# EAGLE design SEGplug (EAGLE 6.2)
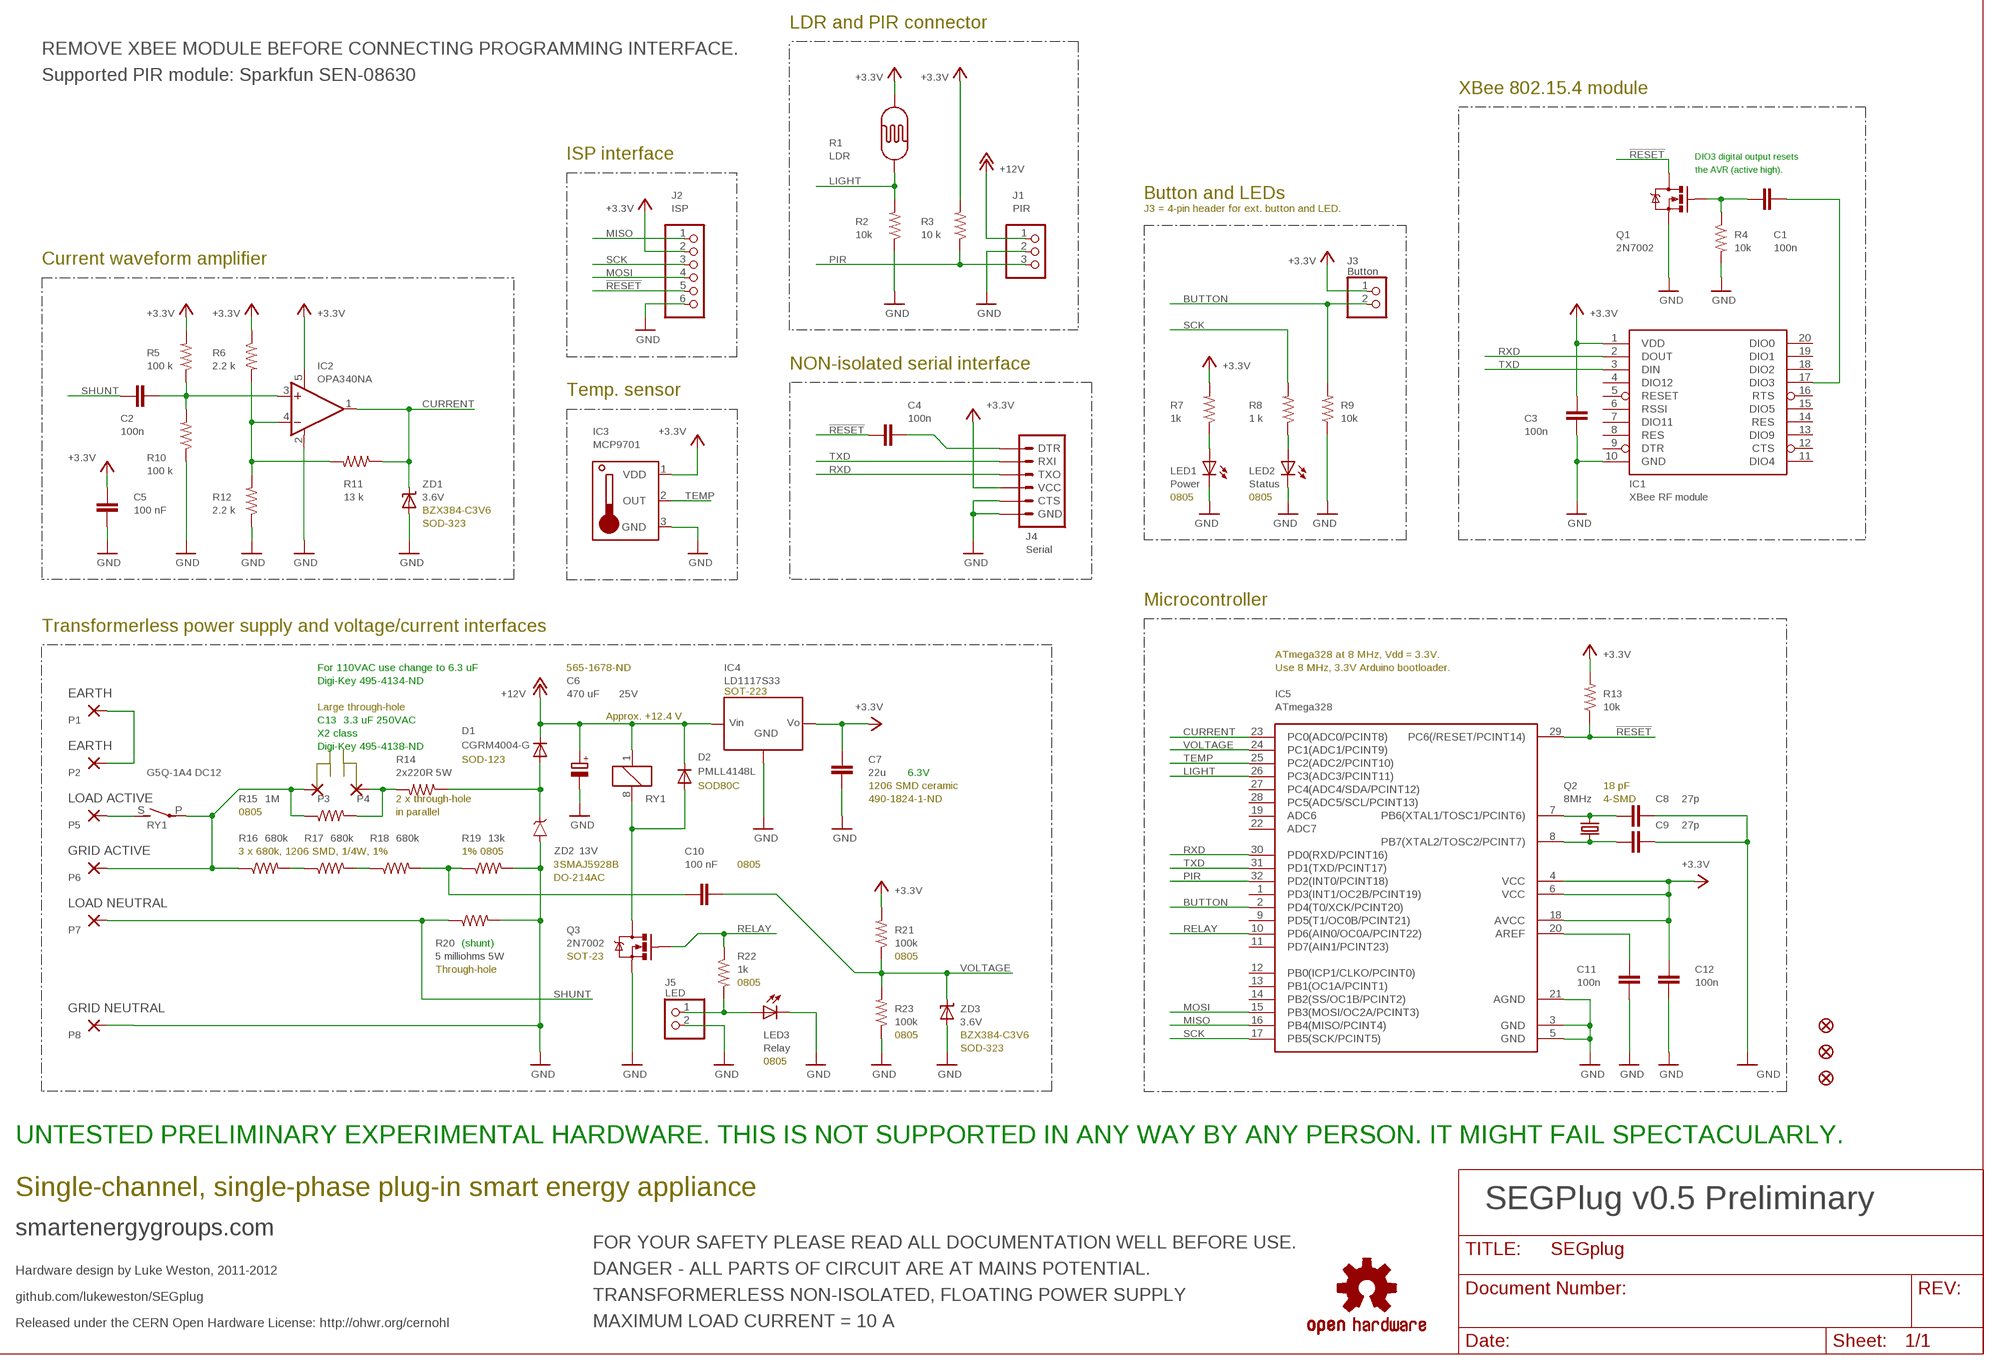
[diagram p0: schematic, sheet 1, part 1 of 2]
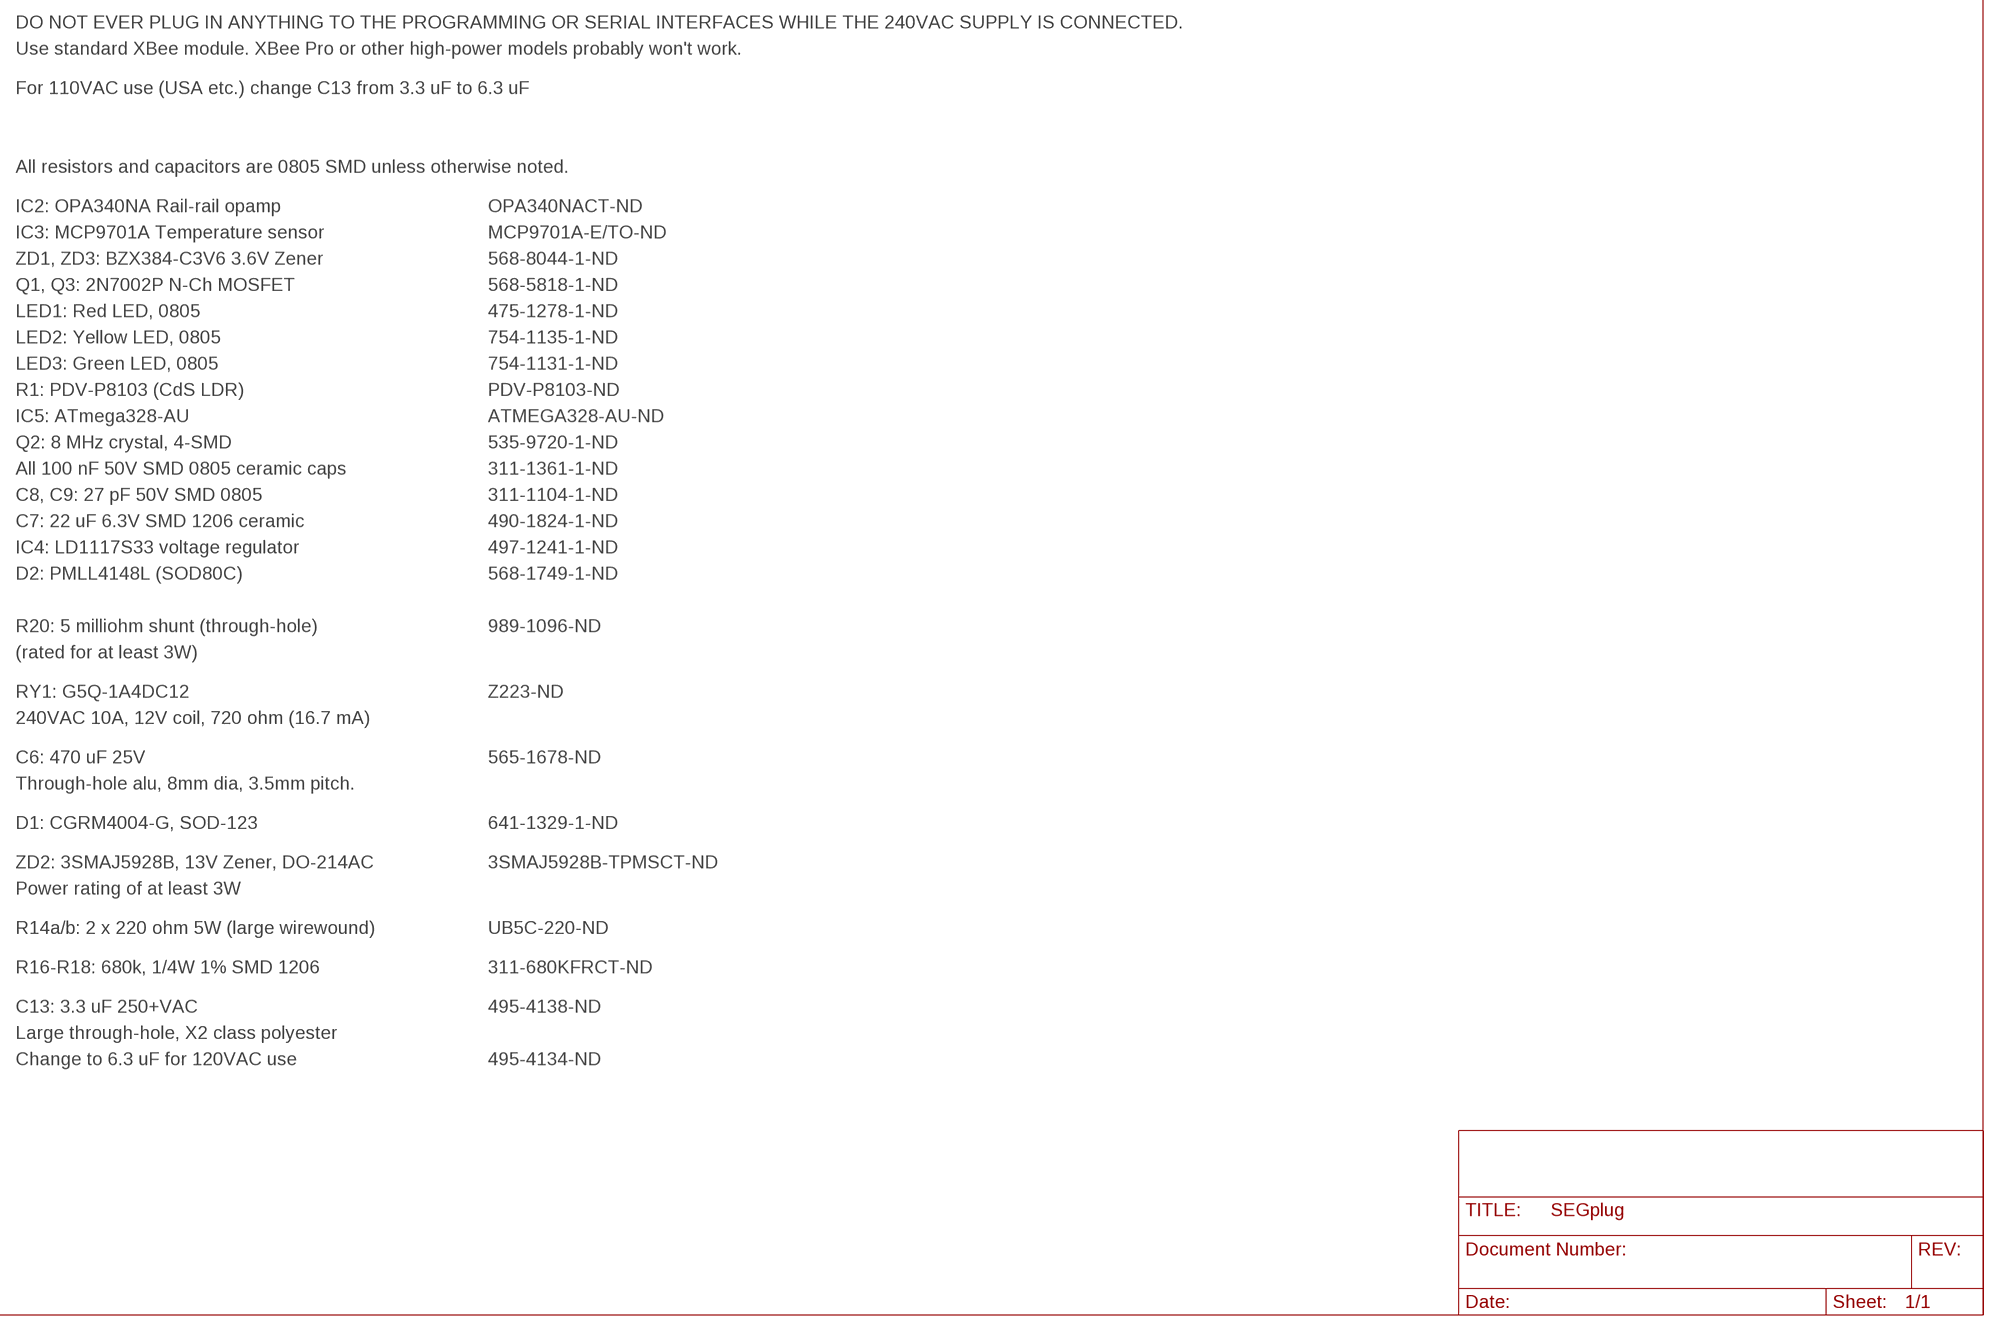
[diagram p1: schematic, sheet 1, part 2 of 2]

## Parts
C1  100n  C-EUC0805K  [C0805K]
C2  100n  C-EUC0805K  [C0805K]
C3  100n  C-EUC0805K  [C0805K]
C4  100n  C-EUC0805K  [C0805K]
C5  100 nF  C-EUC0805K  [C0805K]
C6  470 uF  CPOL-EUE3.5-8  [E3,5-8]
C7  22u  C-EUC1206K  [C1206K]
C8  27p  C-EUC0805K  [C0805K]
C9  27p  C-EUC0805K  [C0805K]
C10  100 nF  C-EUC0805K  [C0805K]
C11  100n  C-EUC0805K  [C0805K]
C12  100n  C-EUC0805K  [C0805K]
D1  CGRM4004-G  [SOD-123_MINI-SMA]
D2  PMLL4148L  DIODE-MINIMELF  [MINIMELF]
IC1  XBee RF module  XBEE-1B3  [XBEE-SMD]
IC2  OPA340NA  OPA336N  [SOT23-5]
IC3  MCP9701  MCP9700  [TO92]
IC4  LD1117S33  REG1117  [SOT223]
IC5  ATmega328  MEGA48/88/168-AU  [TQFP32-08]
J1  PIR  PINHD-1X3  [1X03]
J2  ISP  PINHD-1X6  [1X06]
J3  Button  PINHD-1X2  [1X02]
J4  Serial  ARDUINO_SERIAL_PROGRAMPTH  [1X06]
J5  LED  PINHD-1X2  [1X02]
JP1  FIDUCIAL1X2  [FIDUCIAL-1X2]
JP2  FIDUCIAL1X2  [FIDUCIAL-1X2]
JP3  FIDUCIAL1X2  [FIDUCIAL-1X2]
LED1  Power  LEDCHIPLED_0805  [CHIPLED_0805]
LED2  Status  LEDCHIPLED_0805  [CHIPLED_0805]
LED3  Relay  LEDCHIPLED_0805  [CHIPLED_0805]
P1  EARTH  WIREPAD4,16O1,6  [4,16O1,6]
P2  EARTH  WIREPAD4,16O1,6  [4,16O1,6]
P3  CAP  WIREPAD4,16O1,6  [4,16O1,6]
P4  CAP  WIREPAD4,16O1,6  [4,16O1,6]
P5  LOAD ACTIVE  WIREPAD4,16O1,6  [4,16O1,6]
P6  GRID ACTIVE  WIREPAD4,16O1,6  [4,16O1,6]
P7  LOAD NEUTRAL  WIREPAD4,16O1,6  [4,16O1,6]
P8  GRID NEUTRAL  WIREPAD4,16O1,6  [4,16O1,6]
Q1  2N7002  MOSFET-NCHANNELSMD  [SOT23-3]
Q2  8MHz  CRYSTAL5X3  [CRYSTAL-SMD-5X3]
Q3  2N7002  MOSFET-NCHANNELSMD  [SOT23-3]
R1  LDR  PHOTOCELLPTH  [PHOTOCELL]
R2  10k  R-US_M0805  [M0805]
R3  10 k  R-US_M0805  [M0805]
R4  10k  R-US_M0805  [M0805]
R5  100 k  R-US_M0805  [M0805]
R6  2.2 k  R-US_M0805  [M0805]
R7  1k  R-US_M0805  [M0805]
R8  1 k  R-US_M0805  [M0805]
R9  10k  R-US_M0805  [M0805]
R10  100 k  R-US_M0805  [M0805]
R11  13 k  R-US_M0805  [M0805]
R12  2.2 k  R-US_M0805  [M0805]
R13  10k  R-US_M0805  [M0805]
R14  2x220R 5W  R-US_0617/17  [0617/17]
R15  1M  R-US_M0805  [M0805]
R16  680k  R-US_M1206  [M1206]
R17  680k  R-US_M1206  [M1206]
R18  680k  R-US_M1206  [M1206]
R19  13k  R-US_M0805  [M0805]
R20  5 milliohms 5W  RSENSE2_RSENSE  [RSENSE2_RSENSE]
R21  100k  R-US_M0805  [M0805]
R22  1k  R-US_M0805  [M0805]
R23  100k  R-US_M0805  [M0805]
RY1  G5Q-1A4 DC12  G6C-1117P  [G6C-1117P]
U$  OSHW-LOGOS  [OSHW-LOGO-S]
ZD1  3.6V  DIODE-ZENER-BZT52  [SOD-323]
ZD2  13V  ZENER  [DO214AC]
ZD3  3.6V  DIODE-ZENER-BZT52  [SOD-323]

## Nets
!RESET: C4.2 IC5.29(PC6(/RESET/PCINT14)) J2.5 Q1.3(D) R13.1
+3V3: C3.1 C5.1 C7.1 C12.1 IC1.1(VDD) IC2.5(V+) IC3.1(VDD) IC4.2(VOUT) IC5.4(VCC) IC5.6(VCC) IC5.18(AVCC) J2.2 J3.1 J4.4(VCC) R1.2 R3.2 R5.2 R6.1 R7.2 R13.2 R21.2 ; supply symbol labelled +3.3V
+12V: C6.+ D1.C D2.C IC4.3(VIN) J1.1 RY1.1
BUTTON: IC5.2(PD4(T0/XCK/PCINT20)) J3.2 R9.2
CURRENT: IC2.1(OUT) IC5.23(PC0(ADC0/PCINT8)) R11.1 ZD1.1(C)
DIO3: C1.1 IC1.17(DIO3)
GND: C3.2 C5.2 C6.- C7.2 C8.2 C9.2 C11.2 C12.2 IC1.10(GND) IC2.2(V-) IC3.3(GND) IC4.1(GND) IC5.3(GND) IC5.5(GND) IC5.21(AGND) J1.2 J2.6 J4.5(CTS) J4.6(GND) J5.2 LED1.C LED2.C LED3.C P8.1(P) Q1.2(S) Q3.2(S) R2.1 R4.2 R9.1 R10.1 R12.1 R19.2 R20.P$2 R23.1 ZD1.2(A) ZD2.A ZD3.2(A)
LIGHT: IC5.26(PC3(ADC3/PCINT11)) R1.1 R2.2
MISO: IC5.16(PB4(MISO/PCINT4)) J2.1
MOSI: IC5.15(PB3(MOSI/OC2A/PCINT3)) J2.4
N$1: LED1.A R7.1
N$2: P3.1(P) P6.1(P) R15.1 R16.1 RY1.P(2:P)
N$3: R17.2 R18.1
N$4: D2.A Q3.3(D) RY1.8
N$5: J5.1 LED3.A R22.2
N$6: P5.1(P) RY1.S(2:S)
N$9: C11.1 IC5.20(AREF)
N$10: P1.1(P) P2.1(P)
N$13: C8.1 IC5.7(PB6(XTAL1/TOSC1/PCINT6)) Q2.3
N$14: C9.1 IC5.8(PB7(XTAL2/TOSC2/PCINT7)) Q2.1
N$16: LED2.A R8.1
N$18: C1.2 Q1.1(G) R4.1
N$20: P4.1(P) R14.2 R15.2
N$22: D1.A R14.1 ZD2.C
N$23: C10.2 R18.2 R19.1
N$24: C4.1 J4.1(DTR)
N$25: R16.2 R17.1
N$26: IC2.4(-IN) R6.2 R11.2 R12.2
N$28: C2.1 IC2.3(+IN) R5.1 R10.2
PIR: IC5.32(PD2(INT0/PCINT18)) J1.3 R3.1
RELAY: IC5.10(PD6(AIN0/OC0A/PCINT22)) Q3.1(G) R22.1
RXD: IC1.2(DOUT) IC5.30(PD0(RXD/PCINT16)) J4.3(TXO)
SCK: IC5.17(PB5(SCK/PCINT5)) J2.3 R8.2
SHUNT: C2.2 P7.1(P) R20.P$1
TEMP: IC3.2(OUT) IC5.25(PC2(ADC2/PCINT10))
TXD: IC1.3(DIN) IC5.31(PD1(TXD/PCINT17)) J4.2(RXI)
VOLTAGE: C10.1 IC5.24(PC1(ADC1/PCINT9)) R21.1 R23.2 ZD3.1(C)
Unconnected: IC1.4(DIO12) IC1.5(RESET) IC1.6(RSSI) IC1.7(DIO11) IC1.8(RES) IC1.9(DTR) IC1.11(DIO4) IC1.12(CTS) IC1.13(DIO9) IC1.14(RES) IC1.15(DIO5) IC1.16(RTS) IC1.18(DIO2) IC1.19(DIO1) IC1.20(DIO0) IC5.1(PD3(INT1/OC2B/PCINT19)) IC5.9(PD5(T1/OC0B/PCINT21)) IC5.11(PD7(AIN1/PCINT23)) IC5.12(PB0(ICP1/CLKO/PCINT0)) IC5.13(PB1(OC1A/PCINT1)) IC5.14(PB2(SS/OC1B/PCINT2)) IC5.19(ADC6) IC5.22(ADC7) IC5.27(PC4(ADC4/SDA/PCINT12)) IC5.28(PC5(ADC5/SCL/PCINT13))

## Notes on the sheet
- LDR and PIR connector
- REMOVE XBEE MODULE BEFORE CONNECTING PROGRAMMING INTERFACE.
- Supported PIR module: Sparkfun SEN-08630
- XBee 802.15.4 module
- ISP interface | DIO3 digital output resets
- the AVR (active high).
- Button and LEDs
- J3 = 4-pin header for ext. button and LED.
- Current waveform amplifier
- NON-isolated serial interface
- Temp. sensor
- 0805 | 0805
- BZX384-C3V6
- SOD-323
- Microcontroller
- Transformerless power supply and voltage/current interfaces
- ATmega328 at 8 MHz, Vdd = 3.3V.
- For 110VAC use change to 6.3 uF | 565-1678-ND | Use 8 MHz, 3.3V Arduino bootloader.
- Digi-Key 495-4134-ND
- 25V | SOT-223
- Large through-hole
- Approx. +12.4 V
- C13 | 3.3 uF 250VAC
- X2 class
- Digi-Key 495-4138-ND
- SOD-123
- 6.3V
- SOD80C | 1206 SMD ceramic | 18 pF
- 2 x through-hole | 490-1824-1-ND | 4-SMD
- 0805 | in parallel
- 3 x 680k, 1206 SMD, 1/4W, 1% | 1% 0805
- 3SMAJ5928B | 0805
- DO-214AC
- (shunt)
- SOT-23 | 0805
- Through-hole
- 0805
- 0805 | BZX384-C3V6
- SOD-323
- 0805
- UNTESTED PRELIMINARY EXPERIMENTAL HARDWARE. THIS IS NOT SUPPORTED IN ANY WAY BY ANY PERSON. IT MIGHT FAIL SPECTACULARLY.
- Single-channel, single-phase plug-in smart energy appliance
- SEGPlug v0.5 Preliminary
- smartenergygroups.com
- FOR YOUR SAFETY PLEASE READ ALL DOCUMENTATION WELL BEFORE USE.
- Hardware design by Luke Weston, 2011-2012 | DANGER - ALL PARTS OF CIRCUIT ARE AT MAINS POTENTIAL.
- github.com/lukeweston/SEGplug | TRANSFORMERLESS NON-ISOLATED, FLOATING POWER SUPPLY
- Released under the CERN Open Hardware License: http://ohwr.org/cernohl | MAXIMUM LOAD CURRENT = 10 A
- DO NOT EVER PLUG IN ANYTHING TO THE PROGRAMMING OR SERIAL INTERFACES WHILE THE 240VAC SUPPLY IS CONNECTED.
- Use standard XBee module. XBee Pro or other high-power models probably won't work.
- For 110VAC use (USA etc.) change C13 from 3.3 uF to 6.3 uF
- All resistors and capacitors are 0805 SMD unless otherwise noted.
- IC2: OPA340NA Rail-rail opamp | OPA340NACT-ND
- IC3: MCP9701A Temperature sensor | MCP9701A-E/TO-ND
- ZD1, ZD3: BZX384-C3V6 3.6V Zener | 568-8044-1-ND
- Q1, Q3: 2N7002P N-Ch MOSFET | 568-5818-1-ND
- LED1: Red LED, 0805 | 475-1278-1-ND
- LED2: Yellow LED, 0805 | 754-1135-1-ND
- LED3: Green LED, 0805 | 754-1131-1-ND
- R1: PDV-P8103 (CdS LDR) | PDV-P8103-ND
- IC5: ATmega328-AU | ATMEGA328-AU-ND
- Q2: 8 MHz crystal, 4-SMD | 535-9720-1-ND
- All 100 nF 50V SMD 0805 ceramic caps | 311-1361-1-ND
- C8, C9: 27 pF 50V SMD 0805 | 311-1104-1-ND
- C7: 22 uF 6.3V SMD 1206 ceramic | 490-1824-1-ND
- IC4: LD1117S33 voltage regulator | 497-1241-1-ND
- D2: PMLL4148L (SOD80C) | 568-1749-1-ND
- R20: 5 milliohm shunt (through-hole) | 989-1096-ND
- (rated for at least 3W)
- RY1: G5Q-1A4DC12 | Z223-ND
- 240VAC 10A, 12V coil, 720 ohm (16.7 mA)
- C6: 470 uF 25V | 565-1678-ND
- Through-hole alu, 8mm dia, 3.5mm pitch.
- D1: CGRM4004-G, SOD-123 | 641-1329-1-ND
- ZD2: 3SMAJ5928B, 13V Zener, DO-214AC | 3SMAJ5928B-TPMSCT-ND
- Power rating of at least 3W
- R14a/b: 2 x 220 ohm 5W (large wirewound) | UB5C-220-ND
- R16-R18: 680k, 1/4W 1% SMD 1206 | 311-680KFRCT-ND
- C13: 3.3 uF 250+VAC | 495-4138-ND
- Large through-hole, X2 class polyester
- Change to 6.3 uF for 120VAC use | 495-4134-ND

## Library data of the parts
C1-C5 C7-C12 = rcl:C-EU: CAPACITOR, European symbol
C6 = rcl:CPOL-EU: POLARIZED CAPACITOR, European symbol
D1 = diode:CGRM400*-G: Molded plasitc,JEDEC SOD-123/Mini SMA Source: Comchip CGRM4001-G.pdf
D2 = diode:DIODE-: DIODE
IC1 = SparkFun:XBEE-1
IC2 = burr-brown:OPA336: CMOS Operational Amplifiers Single-Supply, MicroPower, MicroAmplifier(TM) Series; MPN: OPA336NA; OC_FARNELL: 1212297; OC_NEWARK: 01M8405
IC3 = Luke:MCP9700
IC4 = burr-brown:REG1117: 800mA and 1A Low Dropout (LDO) Positive Regulator 1.8V, 2.5V, 2.85V, 3.3V, 5V, and Adj; MPN: REG1117; OC_FARNELL: 1097566; OC_NEWARK: 14P6981
IC5 = avr-5:MEGA48/88/168
J1 = pinhead:PINHD-1X3: PIN HEADER
J2 = pinhead:PINHD-1X6: PIN HEADER
J3 J5 = pinhead:PINHD-1X2: PIN HEADER
J4 = SparkFun:ARDUINO_SERIAL_PROGRAM
JP1-JP3 = SparkFun:FIDUCIAL: Fiducial Alignment Points Various fiducial points for machine vision alignment.
LED1-LED3 = led:LED: LED OSRAM: - CHIPLED LG R971, LG N971, LY N971, LG Q971, LY Q971, LO R971, LY R971 LH N974, LH R974 LS Q976, LO Q976, LY Q976 LO Q996 - Hyper CHIPLED LW Q18S LB Q993, LB Q99A, LB R99A - SideLED LS A670, LO A670, LY A670, LG A670, LP A670 LB A673, LV A673, LT A673, LW A673 LH A674 LY A675 LS A676, LA A676, LO A676, LY A676, LW A676 LS A679, LY A679, LG A679 - Hyper Micro SIDELED® LS Y876, LA Y876, LO Y876, LY Y876 LT Y87S - SmartLED LW L88C, LW L88S LB L89C, LB L89S, LG L890 LS L89K, LO L89K, LY L89K LS L896, LA L896, LO L896, LY L896 - TOPLED LS T670, LO T670, LY T670, LG T670, LP T670 LSG T670, LSP T670, LSY T670, LOP T670, LYG T670 LG T671, LOG T671, LSG T671 LB T673, LV T673, LT T673, LW T673 LH T674 LS T676, LA T676, LO T676, LY T676, LB T676, LH T676, LSB T676, LW T676 LB T67C, LV T67C, LT T67C, LS T67K, LO T67K, LY T67K, LW E67C LS E67B, LA E67B, LO E67B, LY E67B, LB E67C, LV E67C, LT E67C LW T67C LS T679, LY T679, LG T679 LS T770, LO T770, LY T770, LG T770, LP T770 LB T773, LV T773, LT T773, LW T773 LH T774 LS E675, LA E675, LY E675, LS T675 LS T776, LA T776, LO T776, LY T776, LB T776 LHGB T686 LT T68C, LB T68C - Hyper Mini TOPLED® LB M676 - Mini TOPLED Santana® LG M470 LS M47K, LO M47K, LY M47K Source: http://www.osram.convergy.de LUXEON: - LUMILED® LXK2-PW12-R00, LXK2-PW12-S00, LXK2-PW14-U00, LXK2-PW14-V00 LXK2-PM12-R00, LXK2-PM12-S00, LXK2-PM14-U00 LXK2-PE12-Q00, LXK2-PE12-R00, LXK2-PE12-S00, LXK2-PE14-T00, LXK2-PE14-U00 LXK2-PB12-K00, LXK2-PB12-L00, LXK2-PB12-M00, LXK2-PB14-N00, LXK2-PB14-P00, LXK2-PB14-Q00 LXK2-PR12-L00, LXK2-PR12-M00, LXK2-PR14-Q00, LXK2-PR14-R00 LXK2-PD12-Q00, LXK2-PD12-R00, LXK2-PD12-S00 LXK2-PH12-R00, LXK2-PH12-S00 LXK2-PL12-P00, LXK2-PL12-Q00, LXK2-PL12-R00 Source: www.luxeon.com KINGBRIGHT: KA-3528ASYC Source: www.kingbright.com
P1-P8 = wirepad:WIREPAD: Wire PAD connect wire on PCB
Q1 Q3 = freetronics-master-v1:MOSFET-NCHANNEL
Q2 = SparkFun:CRYSTAL: Crystals Various standard crystals. Proven footprints. Spark Fun Electronics SKU : COM-00534
R1 = SparkFun:PHOTOCELL
R2-R13 R19 R21-R23 = resistor:R-US_: RESISTOR, American symbol
R14-R18 = rcl:R-US_: RESISTOR, American symbol
R20 = SEGplug:RSENSE2_RSENSE
RY1 = relay:G6C-1117P: RELAY 1 x norm. open, 10 A/240 V, Omron; OC_FARNELL: unknown; OC_NEWARK: unknown
U$ = SparkFun:OSHW-LOGO: Open Source Hardware Logo This logo indicates the piece of hardware it is found on incorporates a OSHW license and/or adheres to the definition of open source hardware found here: http://freedomdefined.org/OSHW
ZD1 ZD3 = SparkFun:DIODE-ZENER: Zener Diode Production Part - 8199 3.4V Zener Voltage
ZD2 = Luke:ZENER

## Board
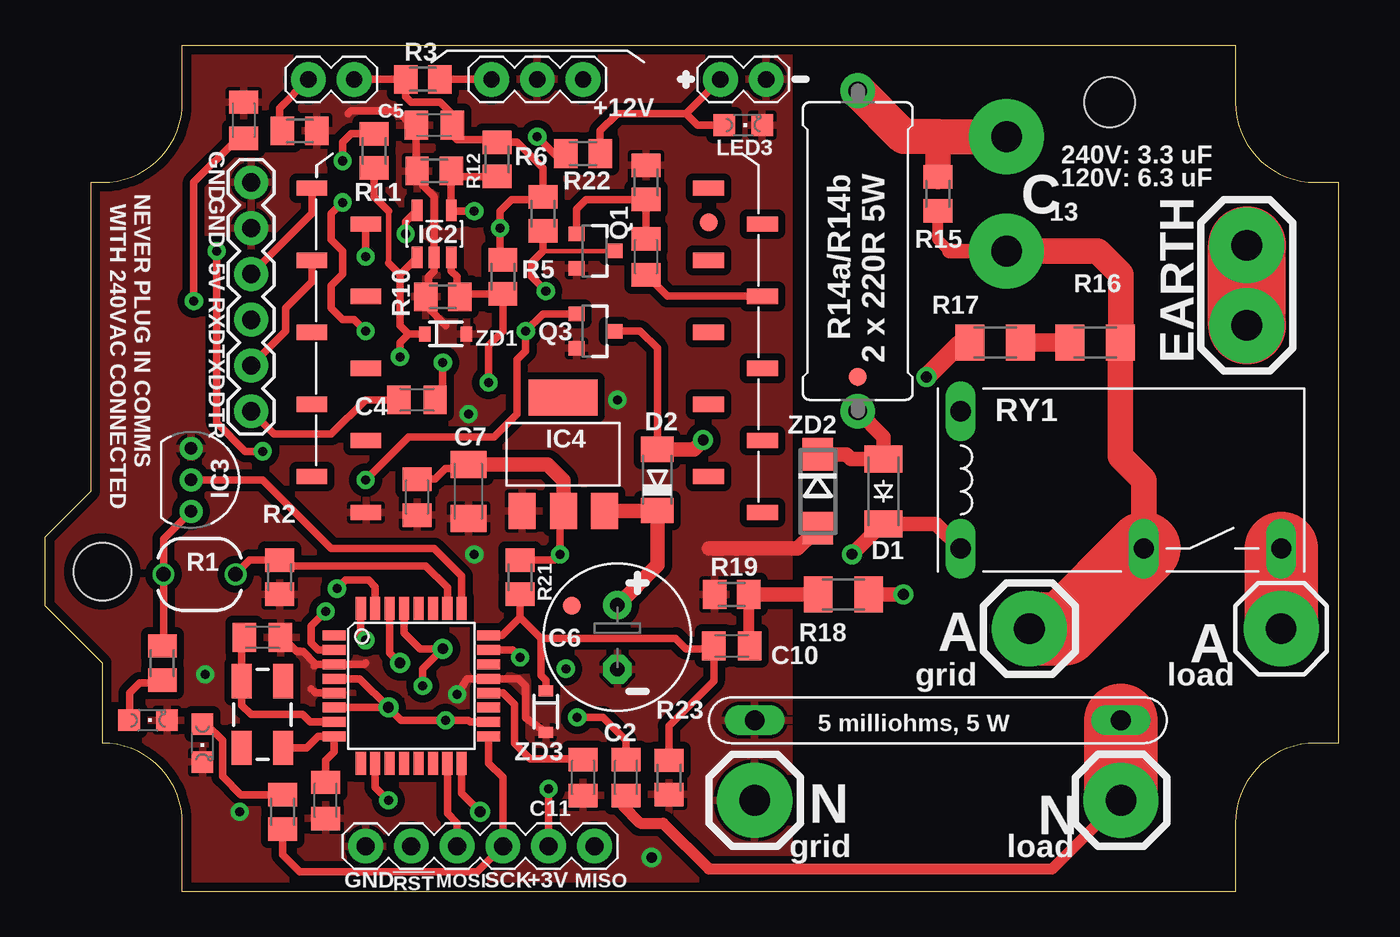
[diagram p2: board, top side]
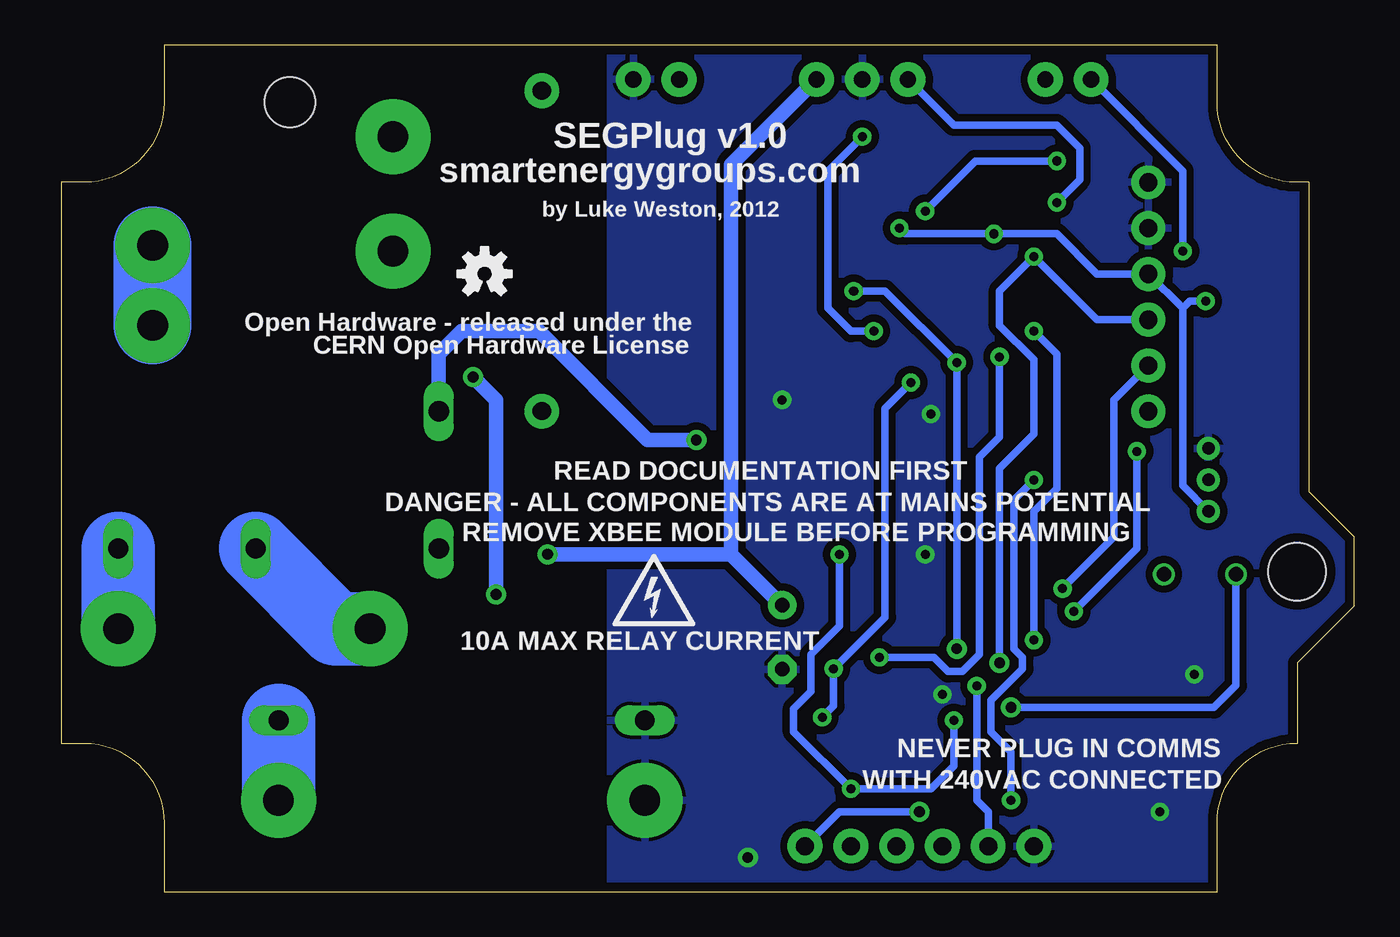
[diagram p3: board, bottom side, seen from below]

Size 71.75 x 46.99 mm. Coordinates in mm from the lower left corner, seen from the top.
Outline: 2.54,39.37 3.17,39.37 arc90 7.62,43.81 7.62,46.99 66.04,46.99 66.04,43.81 arc90 70.48,39.37 71.75,39.37 71.75,8.25 70.48,8.25 arc90 66.04,3.81 66.04,0 7.62,0 7.62,3.81 arc90 3.17,8.25 3.17,12.7 0,15.88 0,19.69 2.54,22.23 2.54,39.37
Copper layers (1*16): Top 0.035mm / dielectric 1.5mm / Bottom 0.035mm
Design rules: minimum track width 8mil, minimum drill 0.4mm, track to track 8mil, track to pad 8mil, pad to pad 8mil, via to via 8mil, smd to smd 8mil, copper to edge 20mil, drill to drill 8mil, minimum pad ring 8mil, minimum via ring 10mil, stop-mask expansion 3mil, vias tented up to drill 0mil, thermal gap 8mil
Holes 3.2 mm at 3.17,17.78
Holes 2.8 mm at 59.05,43.81

### Footprints (pad centres in the part's own frame; a part is rotated, then mirrored left to right if it is on the bottom)
C0805K = smd 1.3 x 1.6: 1 -1,0; 2 1,0
E3,5-8 = drill 0.813 pad 1.6: + -1.778,0 | drill 0.813 pad 1.6 octagon: - 1.778,0
C1206K = smd 1.5 x 2: 1 -1.5,0; 2 1.5,0
SOD-123_MINI-SMA = smd 1.5 x 2.1: A 1.8,0; C -1.8,0
MINIMELF = smd 1.4 x 1.8: A 1.7,0; C -1.7,0
XBEE-SMD = smd 1.7 x 0.85: 1 -12.5,20; 2 -9.5,18; 3 -12.5,16; 4 -9.5,14; 5 -12.5,12; 6 -9.5,10; 7 -12.5,8; 8 -9.5,6; 9 -12.5,4; 10 -9.5,2; 11 12.5,2; 12 9.5,4; 13 12.5,6; 14 9.5,8; 15 12.5,10; 16 9.5,12; 17 12.5,14; 18 9.5,16; 19 12.5,18; 20 9.5,20
SOT23-5 = smd 0.6 x 1.2: 1 -0.95,-1.306; 2 0,-1.306; 3 0.95,-1.306; 4 0.95,1.306; 5 -0.95,1.306
TO92 = drill 0.7 pad 1.27: 1 1.746,-0.159; 2 0,-0.159; 3 -1.746,-0.159
SOT223 = smd 1.499 x 2.007: 1 -2.261,-3.15; 2 0.025,-3.15; 3 2.311,-3.15 | smd 3.81 x 2.007: 4 0,3.15
TQFP32-08 = smd 1.27 x 0.559: 1 -4.293,2.8; 2 -4.293,2; 3 -4.293,1.2; 4 -4.293,0.4; 5 -4.293,-0.4; 6 -4.293,-1.2; 7 -4.293,-2; 8 -4.293,-2.8; 17 4.293,-2.8; 18 4.293,-2; 19 4.293,-1.2; 20 4.293,-0.4; 21 4.293,0.4; 22 4.293,1.2; 23 4.293,2; 24 4.293,2.8 | smd 0.559 x 1.27: 9 -2.8,-4.293; 10 -2,-4.293; 11 -1.2,-4.293; 12 -0.4,-4.293; 13 0.4,-4.293; 14 1.2,-4.293; 15 2,-4.293; 16 2.8,-4.293; 25 2.8,4.293; 26 2,4.293; 27 1.2,4.293; 28 0.4,4.293; 29 -0.4,4.293; 30 -1.2,4.293; 31 -2,4.293; 32 -2.8,4.293
1X03 = drill 0.9 pad 1.93: 1 -2.54,0; 2 0,0; 3 2.54,0
1X06 = drill 1 pad 1.93: 1 -6.35,0; 2 -3.81,0; 3 -1.27,0; 4 1.27,0; 5 3.81,0; 6 6.35,0
1X02 = drill 0.9 pad 1.93: 1 -1.27,0; 2 1.27,0
1X06' = drill 1.016 pad 1.88: 1 0,0; 2 2.54,0; 3 5.08,0; 4 7.62,0; 5 10.16,0; 6 12.7,0
FIDUCIAL-1X2 = smd 1 x 1: 1 0,0
CHIPLED_0805 = smd 1.2 x 1.2: A 0,-1.05; C 0,1.05
4,16O1,6 = drill 1.702 pad 4.166: 1 0,0
SOT23-3 = smd 0.8 x 0.9: 1 -0.95,-1; 2 0.95,-1; 3 0,1.1
CRYSTAL-SMD-5X3 = smd 1.9 x 1.1: 1 -1.85,-1.15; 2 1.85,-1.15; 3 1.85,1.15; 4 -1.85,1.15
PHOTOCELL = drill 0.8: 1 -2,0; 2 2,0
M0805 = smd 1.3 x 1.6: 1 -0.95,0; 2 0.95,0
0617/17 = drill 1 pad 1.93: 1 -8.89,0; 2 8.89,0
M1206 = smd 1.6 x 2: 1 -1.4,0; 2 1.4,0
RSENSE2_RSENSE = drill 1.1 long: P$1 -10.16,0; P$2 10.16,0
G6C-1117P = drill 1.118 long: 1 -8.89,-5.08; 8 -8.89,2.54; P 1.27,-5.08; S 8.89,-5.08
SOD-323 = smd 0.63 x 0.83: 1 -1.15,0; 2 1.15,0
DO214AC = smd 1.8 x 1.7: A 2.05,0; C -2.05,0

### Placement (x,y rotation side)
C1  33.34,35.24 90 top
C2  32.23,6.35 270 top
C3  11.02,42.82 90 top
C4  20.64,27.3 0 top
C5  21.59,42.54 180 top
C6  31.75,14.13 270 top
C7  23.49,22.23 270 top
C8  12.07,14.13 0 top
C9  15.56,5.08 270 top
C10  38.1,13.65 0 top
C11  29.84,6.35 270 top
C12  20.64,21.91 270 top
D1  46.51,22.23 90 top
D2  33.97,22.86 90 top
IC1  27.3,19.05 0 top
IC2  21.59,36.51 0 top
IC3  8.26,22.86 270 top
IC4  28.73,24.29 0 top
IC5  20.32,11.43 0 top
J1  27.3,45.09 180 top
J2  24.13,2.54 180 top
J3  15.88,45.09 180 top
J4  Serial  [1X06']  11.43,26.67 90 top
J5  38.73,45.09 0 top
JP1  36.83,37.15 0 top
JP2  29.21,15.88 0 top
JP3  45.09,28.57 0 top
LED1  5.71,9.52 270 top
LED2  8.73,8.26 180 top
LED3  38.73,42.55 270 top
P1  66.67,31.43 90 top
P2  66.67,35.88 90 top
P3  53.34,35.56 0 top
P4  53.34,41.91 0 top
P5  68.58,14.61 0 top
P6  54.61,14.61 0 top
P7  59.69,5.08 0 top
P8  39.37,5.08 0 top
Q1  30.48,35.56 270 top
Q2  12.07,9.84 90 top
Q3  30.48,31.12 270 top
R1  8.57,17.62 180 top
R2  13.02,17.46 90 top
R3  20.95,45.09 180 top
R4  33.34,39.37 90 top
R5  25.4,34.13 90 top
R6  25.08,40.64 270 top
R7  6.51,12.7 90 top
R8  13.18,4.45 270 top
R9  14.13,42.23 180 top
R10  22.07,33.02 0 top
R11  18.26,41.12 90 top
R12  21.59,40 0 top
R13  27.62,37.62 90 top
R14  45.09,35.56 90 top
R15  49.53,38.73 90 top
R16  58.26,30.48 180 top
R17  52.71,30.48 180 top
R18  44.29,16.51 180 top
R19  38.1,16.51 180 top
R20  49.53,9.52 180 top
R21  26.35,17.46 90 top
R22  29.84,40.96 0 top
R23  34.61,6.35 90 top
RY1  59.69,24.13 0 top
U$  48.26,34.29 0 bottom
ZD1  22.22,30.96 0 top
ZD2  42.86,22.23 270 top
ZD3  27.78,10 270 top

### Tracks (layer width: path | path; a pad name or v marks a point on that pad's centre or on a via)
!RESET  (via drill 0.5, 0.6)
  Top 0.254: 27.62,35.56 Q1.3
  Top 0.406: 19.92,14.37 IC5.29 | v22.07,29.37 22.07,27.78 21.64,27.35 C4.2 | 19.92,14.37 | 19.92,14.37 20.8,13.49 v22.07,13.49 20.95,12.38 v20.95,11.43 | v27.78,33.34 26.99,34.13 26.99,34.93 27.62,35.56 R13.1
  Bottom 0.406: J2.5 20.32,4.45 20.95,5.08 v20.95,11.43 | v22.07,13.49 v22.07,29.37 26.04,33.34 v27.78,33.34
+3V3  (via drill 0.5, 0.6)
  Top 0.406: IC5.18 23.59,9.43 23.49,9.52 v22.22,9.52 19.75,9.52 v19.05,10.23 | v27.94,5.72 J2.2 | IC5.4 17.45,11.83 v19.05,10.23 | IC4.2 28.73,21.11 28.57,20.64 v28.57,18.73 28.25,18.41 R21.2 | J4.4 14.8,37.66 IC1.1 | IC2.5 20.6,37.78 | C5.1 22.54,42.59 | C5.1 22.75,42.07 22.75,41.86 22.86,41.75 24.45,41.75 R6.1 26.2,41.59 27.62,40.16 R13.2 27.47,38.42 25.88,38.42 25.24,37.78 v25.24,36.83 25.24,35.24 R5.2 | IC2.5 | IC3.1 6.57,19.59 R1.2 6.57,13.71 R7.2 | v19.05,10.23 IC5.6 | C12.1 21.64,22.91 22.22,23.5 23.26,23.5 C7.1 | C5.1 22.54,42.27 22.54,43.18 21.91,43.81 20.32,43.81 20,44.13 R3.2 J3.1 | v20,36.51 20,37.18 IC2.5 | C3.1 10.7,41.82 8.26,39.37 v8.26,32.78
  Top 0.813: C7.1 27.87,23.73 28.76,22.84 IC4.2
  Bottom 0.406: 9.53,32.38 J4.4 14.29,34.29 16.51,36.51 19.68,36.51 | v22.22,9.52 22.22,6.99 23.49,5.72 v27.94,5.72 31.11,8.89 31.11,10.16 30.16,11.11 30.16,13.18 29.21,14.13 28.57,14.76 28.57,17.78 v28.57,18.73 | 9.53,32.38 9.53,22.54 IC3.1 | v19.05,10.23 7.79,10.23 6.57,11.45 R1.2 | 9.53,32.38 9.13,32.78 v8.26,32.78 | v25.24,36.83 24.92,36.51 19.68,36.51 | 19.68,36.51 v20,36.51
+12V  (via drill 0.6)
  Top 0.813: v44.77,18.73 46.46,20.43 D1.C 49.43,20.43 RY1.1 | C6.+ 33.97,18.13 D2.C 33.95,21.14 IC4.3
  Bottom 0.813: 34.58,18.73 v44.77,18.73 | C6.+ 34.58,18.73 | 34.58,18.73 34.58,40.35 J1.1
BUTTON  (via drill 0.5)
  Top 0.406: IC5.2 15.15,13.43 14.76,13.81 14.76,14.76 v15.56,15.56 | v12.07,24.45 11.11,24.45 9.53,26.04 v9.53,35.56 | J3.2 13.02,43.5 13.02,42.23 R9.2
  Bottom 0.406: v9.53,35.56 9.53,40.01 J3.2 | v12.07,24.45 12.07,19.05 v15.56,15.56
CURRENT  (via drill 0.5)
  Top 0.305: 19.05,34.89 19.05,37.78
  Top 0.406: 19.68,34.25 IC2.1 | 19.68,34.25 19.05,34.89 | 21.07,31.08 ZD1.1 20.16,30.96 | 26.04,13.34 v26.35,13.02 25.94,13.43 IC5.23 | 19.68,34.25 19.68,31.43 20.16,30.96 | v19.68,29.69 19.68,30.48 20.16,30.96 | R11.1 18.26,38.58 19.05,37.78
  Bottom 0.406: v19.68,29.69 19.68,25.24 20.8,24.13 20.8,13.18 21.75,12.22 22.54,12.22 23.34,13.02 v26.35,13.02
DIO3
  Top 0.406: IC1.17 34.53,33.05 C1.1
GND  (via drill 0.5, 0.6)
  Top 0.406: ZD2.A 42.86,20 42.7,19.84 | 15.01,12.63 IC5.3 17.71,12.63 17.78,12.7 | 15.01,12.63 14.92,12.54 | IC5.5 15.01,11.03 14.92,11.11 14.76,11.27 | 15.01,12.63 14.31,13.34 13.97,13.34 13.18,14.13 C8.2 | R10.1 21.27,33.02 21.27,32.38 22.22,31.43 | R10.1 21.07,33.14 | R10.1 21.27,33.34 21.27,34.13 21.59,34.45 IC2.2 21.59,38.58 20.95,39.21 20.95,39.69 R12.1 20.59,40.05 C5.2 20.59,42.27 19.53,43.34 16.99,43.34 16.83,43.18 | v22.86,10.95 23.42,11.83 IC5.21 26.27,11.83 26.67,11.43 26.67,9.64 ZD3.2
  Top 0.813: 42.7,19.84 42.55,19.84 41.75,19.05 36.83,19.05
  other vias: 33.66,1.91 23.49,26.51 31.75,27.3 10.79,4.45 8.89,12.07 23.81,18.73
  pour Top (isolate 0.406): -1.9,48.26 41.28,48.26 41.28,-0.64 -1.9,-0.64
  pour Bottom (isolate 0.406): -1.9,48.26 41.28,48.26 41.28,-0.64 -1.9,-0.64
LIGHT
  Top 0.406: IC5.26 22.32,16.89 21.11,18.1 13.02,18.1 R2.2 11.36,18.41 R1.1
MISO  (via drill 0.6)
  Top 0.406: IC5.16 23.12,5.46 v24.13,4.45
  Bottom 0.406: v24.13,4.45 28.57,4.45 J2.1
MOSI
  Top 0.406: IC5.15 22.32,4.35 22.86,3.81 J2.4
N$1
  Top 0.305: R7.1 6.67,11.59
  Top 0.406: 6.67,11.59 5.24,11.59 4.68,11.03 4.68,9.7 LED1.A
N$2
  Top 0.61: R15.1 49.53,36.2 50.16,35.56
  Top 0.813: P3.1 50.16,35.56 | R16.1 59.69,30.51
  Top 1.422: R16.1 59.66,24.16 60.96,22.86 60.96,19.69 | P3.1 58.42,35.56 59.69,34.29 59.69,30.51
  Top 2.54: 60.96,19.69 RY1.P 60.96,18.41
  Top 4.064: P6.1 56.52,14.61 RY1.P
  Bottom 4.064: P6.1 56.52,14.61 RY1.P
N$3  (via drill 0.6)
  Top 0.813: R18.1 v47.62,16.51
  Top 1.016: v48.9,28.57 50.72,30.4 51.23,30.4 R17.2
  Bottom 0.813: v48.9,28.57 47.62,27.3 v47.62,16.51
N$4  (via drill 0.6)
  Top 0.406: D2.A 33.97,30.16 33.02,31.12 Q3.3
  Top 0.813: D2.A 35.99,24.56 v36.51,25.08
  Bottom 0.813: v36.51,25.08 39.21,25.08 45.24,31.12 49.53,31.12 50.8,29.84 RY1.8
N$5
  Top 0.406: R22.2 30.79,42.23 31.75,43.18 35.56,43.18 | 35.56,43.18 J5.1 | LED3.A 36.2,42.55 35.56,43.18
N$6
  Top 4.064: P5.1 RY1.S
  Bottom 4.064: P5.1 RY1.S
N$8
  Bottom 2.54: 60.96,19.69 60.96,18.41
N$9
  Top 0.406: IC5.20 25.4,11.03 26.04,10.39 26.04,8.25 26.89,7.39 29.8,7.39 C11.1
N$10
  Top 4.318: P1.1 P2.1
  Bottom 4.318: P1.1 P2.1
N$13
  Top 0.406: IC5.7 14.7,9.43 14.29,9.84 11.43,9.84 10.92,10.36 Q2.3 10.92,13.82 C8.1 10.92,14.2
N$14
  Top 0.406: Q2.1 14.5,7.99 15.14,8.63 IC5.8 16.03,7.77 15.56,7.3 C9.1
N$16
  Top 0.406: LED2.A 8.95,9.3 9.84,8.41 9.84,6.41 10.86,5.39 R8.1
N$18
  Top 0.406: C1.2 R4.1 30,38.42 29.48,37.89 Q1.1
N$20
  Top 1.422: R15.2 49.53,41.91
  Top 1.93: P4.1 49.53,41.91 47.62,41.91 R14.2
N$22
  Top 0.406: ZD2.C 43.11,24.03
  Top 0.813: R14.1 46.51,25.24 D1.A 44.71,24.03 44.46,24.28 ZD2.C
N$23
  Top 0.61: R19.1 39.05,13.7 C10.2
  Top 0.813: R19.1 R18.2
N$24
  Top 0.406: J4.1 12.7,25.4 15.88,25.4 17.78,27.3 C4.1
N$25
  Top 1.016: R17.1 R16.2
N$26  (via drill 0.5)
  Top 0.406: R12.2 IC2.4 22.58,37.78 v23.81,37.78 | R12.2 | 22.86,40.01 22.54,39.69 | R12.2 22.7,40.17 | 18.41,42.07 R11.2 18.41,42.07 16.99,42.07 16.51,41.59 v16.51,40.56 | R12.2 22.86,40.01 | 22.86,40.01 22.86,39.69 24.61,39.69 R6.2
  Bottom 0.406: v16.51,40.56 21.03,40.56 v23.81,37.78
N$28  (via drill 0.5)
  Top 0.406: IC2.3 22.54,34.45 22.86,34.13 22.86,33.34 R10.2 | R10.2 23.17,33.02 | v24.61,28.26 24.61,30.32 25.4,31.12 R5.1 23.18,33.18 R10.2 | C2.1 | C2.1 32.07,7.51 | v29.53,9.68 30.96,9.68 32.23,8.41 C2.1
  Bottom 0.406: v24.61,28.26 26.04,26.83 26.04,15.24 v28.89,12.38 28.89,10.32 v29.53,9.68
PIR  (via drill 0.5)
  Top 0.406: IC5.32 17.52,14.23 v17.78,13.97 | v17.78,31.12 17.14,31.75 16.51,31.75 15.88,32.38 15.88,33.66 16.51,34.29 16.51,35.56 15.88,36.2 15.88,37.62 v16.51,38.26 | J1.3 R3.1
  Bottom 0.406: v17.78,13.97 17.78,21.11 16.51,22.38 16.51,29.84 v17.78,31.12 | J1.3 22.22,42.55 16.51,42.55 15.24,41.27 15.24,39.53 v16.51,38.26
RELAY  (via drill 0.5)
  Top 0.406: IC5.10 18.32,5.81 v19.05,5.08 | v17.78,22.86 20.16,25.24 24.92,25.24 26.19,26.51 26.19,29.53 26.67,30 v26.67,31.12 27.62,32.06 Q3.1 | v27.3,41.91 28.42,40.8 28.74,40.8 R22.1
  Bottom 0.406: v19.05,5.08 19.05,7.78 20.16,8.89 20.16,10.64 18.41,12.38 18.41,13.02 18.89,13.49 18.89,21.75 v17.78,22.86 | v26.67,31.12 27.94,31.12 29.21,32.38 29.21,40.01 v27.3,41.91
RXD  (via drill 0.5, 0.6)
  Top 0.406: IC5.30 19.12,13.27 v19.68,12.7 | v17.78,35.24 17.78,37.02
  Top 0.61: 17.78,37.02 IC1.2
  Bottom 0.406: v19.68,12.7 19.68,23.5 17.78,25.4 17.78,29.53 19.68,31.43 19.68,33.34 v17.78,35.24 14.29,31.75 J4.3
SCK
  Top 0.406: IC5.17 24.61,7.14 25.4,6.35 J2.3 23.97,1.11 14.13,1.11 13.18,2.06 R8.2
SHUNT
  Top 0.61: C2.2 32.07,5.24 32.07,4.76 33.02,3.81 34.29,3.81 36.83,1.27 55.88,1.27 P7.1
  Top 4.064: P7.1 R20.P$1
  Bottom 4.064: P7.1 R20.P$1
TEMP
  Top 0.406: IC5.25 23.12,17.52 21.59,19.05 15.88,19.05 12.07,22.86 IC3.2
TXD  (via drill 0.5)
  Top 0.406: IC5.31 18.32,16.92 17.94,17.3 16.67,17.3 v16.19,16.83 | IC1.3 14.8,33.86 13.34,32.38 13.34,31.12 J4.2
  Bottom 0.406: v16.19,16.83 13.34,19.69 13.34,27.3 J4.2
VOLTAGE
  Top 0.406: IC5.24 25.35,14.24 26.35,15.24 | 27.52,14.07 34.98,14.07 35.56,13.49 36.94,13.49 C10.1 37.1,11.7 34.61,9.21 R23.2 | 27.52,14.07 26.67,14.92 26.35,15.24 | 27.52,14.07 27.52,12.01 27.78,11.75 ZD3.1 | ZD3.1 | 26.35,15.24 R21.1

### Text on the board
tPlace: +12V | GND | 240V: 3.3 uF | 120V: 6.3 uF | WITH 240VAC CONNECTED | NEVER PLUG IN COMMS | GND | C | 13 | 5V | RXD | TXD | R14a/R14b | 2 x 220R 5W | EARTH | DTR | A | A | grid | load | 5 milliohms, 5 W | N | N | grid | load | GND | !RST | MOSI | SCK | +3V | MISO
bPlace: SEGPlug v1.0 | smartenergygroups.com | by Luke Weston, 2012 | Open Hardware - released under the | CERN Open Hardware License | READ DOCUMENTATION FIRST | DANGER - ALL COMPONENTS ARE AT MAINS POTENTIAL | REMOVE XBEE MODULE BEFORE PROGRAMMING | 10A MAX RELAY CURRENT | NEVER PLUG IN COMMS | WITH 240VAC CONNECTED